# Altium schematic sheet LightDimmer.SchDoc
size A4
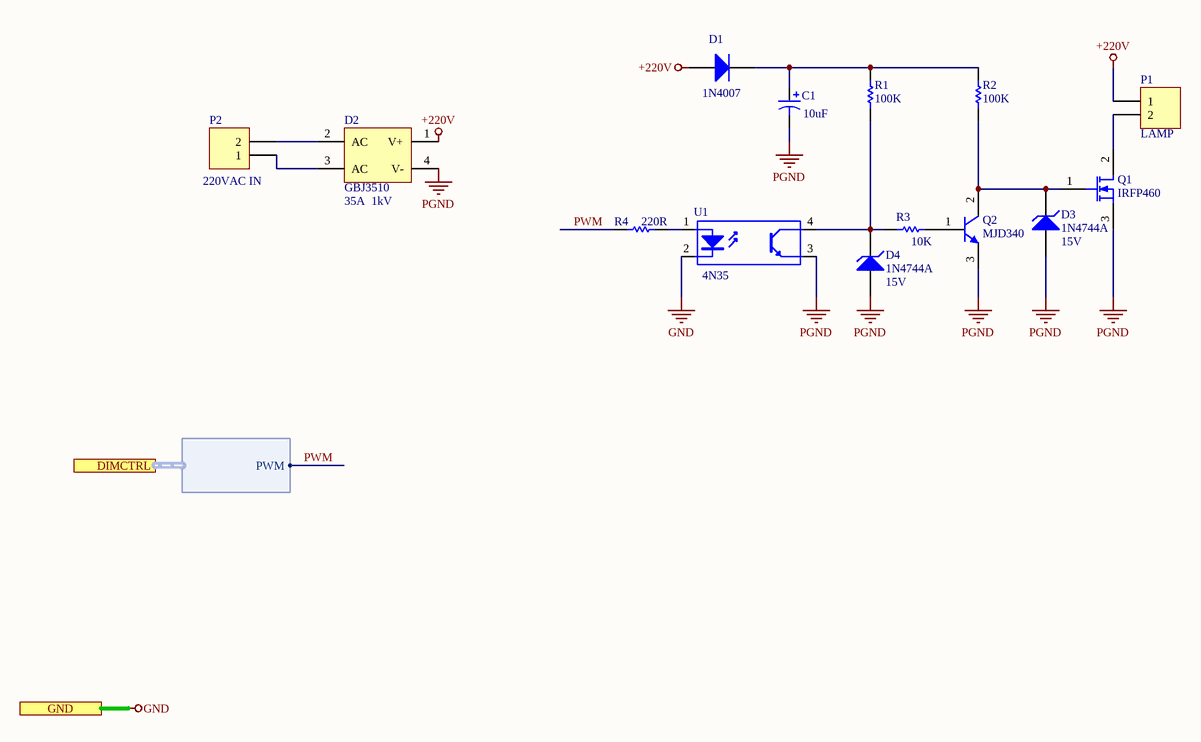
[diagram p0: LightDimmer.SchDoc]

## Parts
C1  value 10uF  [RB7.6-15]  (hidden comment: 10uF/400V)
D1  1N4007  [D-SOD-80]
D2  GBJ3510  Forward Current: 35A  Max Repetitive Reverse Voltage (Vrrm): 1kV  [D-46_6A]
D3  1N4744A  Zener Voltage: 15V  [DIODE-0.7]
D4  1N4744A  Zener Voltage: 15V  [DIODE-0.7]
P1  value LAMP  [HDR1X2]  (hidden comment: KF128-2P)
P2  value 220VAC IN  [HDR1X2]  (hidden comment: KF128-2P)
Q1  IRFP460  [TO-247-3B]
Q2  MJD340  [TO-252-3]
R1  100K  [AXIAL-0.3]
R2  100K  [AXIAL-0.3]
R3  10K  [AXIAL-0.3]
R4  220R  [AXIAL-0.3]
U1  4N35  [DIP-4]

## Ports
DIMCTRL (harness DIMCTRL), GND

## Harnesses
DIMCTRL: PWM

## Nets
+220V: D1.1(A) D2.1(V+) P1.1
GND: U1.2(K) ; port GND
PGND: C1.2 D2.4(V-) D3.1(A) D4.1(A) Q1.3(S) Q2.3(E) U1.3(E)
PWM: R4.2 ; port DIMCTRL.PWM
NetC1_1: C1.1 D1.2(K) R1.1 R2.1
NetD2_2: D2.2(AC) P2.2
NetD2_3: D2.3(AC) P2.1
NetD3_2: D3.2(K) Q1.1(G) Q2.2(C) R2.2
NetD4_2: D4.2(K) R1.2 R3.2 U1.4(C)
NetP1_2: P1.2 Q1.2(D)
NetQ2_1: Q2.1(B) R3.1
NetR4_1: R4.1 U1.1(A)

## Library data of the parts
C1 = Cap Pol1: Polarized Capacitor (Radial); Published: 8-Jun-2000; LatestRevisionDate: 17-Jul-2002; LatestRevisionNote: Re-released for DXP Platform.; PackageReference: RB7.6-15; Publisher: Altium Limited; PackageDescription: Polarized Capacitor (Radial); 2 Leads
D1 = Diode 1N4004: 1 Amp General Purpose Rectifier (M7); Published: 8-Jun-2000; LatestRevisionDate: 17-Jul-2002; LatestRevisionNote: Re-released for DXP Platform.; DatasheetDocument: 1998; PackageDocument: Aug-1999; PackageReference: DO-41; Value: 1N4007; Code_JEDEC: DO-204-AL; ComponentLink1Description: Manufacturer Link; ComponentLink1URL: http://www.fairchildsemi.com/; ComponentLink2Description: Datasheet; ComponentLink2URL: http://www.fairchildsemi.com/ds/1N%2F1N4001.pdf
D2 = Bridge2: 35A/1000V; Manufacturer: MCC; Manufacturer Part Number: GBJ3510-BP; Forward Voltage: 1.05V; Peak Reverse Current: 10uA; Capacitance: 2.2nF; Tolerance: 80%; Voltage Rating: 3.15kV; Max Forward Surge Current (Ifsm): 350A; Number of Elements: 1; Lead/Base Style: Formed Leads; Supplier 1: Digi-Key; Supplier Part Number 1: GBJ3510-BPMS-ND; RoHS: Yes; Stock 1: 4750; Pricing 1: 1 = 2.02000, 10 = 1.82000, 25 = 1.62520, 100 = 1.46250, 250 = 1.30000, 750 = 1.02700, 1500 = 0.94250, 3000 = 0.87750, 5250 = 0.84500 (USD); Mount: Through Hole; Case/Package: Radial; Number of Pins: 4; Min Operating Temperature: -25°C; Max Operating Temperature: 150°C; Package Quantity: 900; Packaging: Bulk; Peak Non-Repetitive Surge Current: 350A; Length: 30.3mm; Height: 20.3mm; Width: 4.8mm; Height - Seated (Max): 0.512inch; Lead Pitch: 0.295inch; Radiation Hardening: No; Lead Free: Lead Free
D3 D4 = D Zener: 1W 15V; Manufacturer: MCC; Manufacturer Part Number: 1N4744A-TP; Material: Glass; Impedance: 14R; Element Configuration: Single; Tolerance: 5%; Max Reverse Leakage Current: 5uA; Test Current: 17mA; Output Current: 1.5A; Zener Current: 61mA; Supplier 1: Digi-Key; Supplier Part Number 1: 1N4744A-TPCT-ND; RoHS: Yes; Stock 1: 4052; Pricing 1: 1 = 0.27000, 10 = 0.24300, 25 = 0.17520, 100 = 0.13630, 250 = 0.08564, 500 = 0.07300, 1000 = 0.04964, 2500 = 0.04478 (USD); Mount: Through Hole; Number of Pins: 2; Min Operating Temperature: -65°C; Max Operating Temperature: 200°C; Packaging: Tape and Reel; Max Power Dissipation: 1W; Voltage Tolerance: 5%; Power Dissipation: 1W; Package Quantity: 1; Voltage Rating (DC): 15V; Power Rating: 1W; Radiation Hardening: No; Lead Free: Lead Free; REACH SVHC: Unknown; ComponentLink1URL: http://www.mccsemi.com/up_pdf/1N4728-1N4761(DO-41G).pdf; ComponentLink1Description: http://www.mccsemi.com/up_pdf/1N4728-1N4761(DO-41G).pdf; ComponentLink2URL: https://www.verical.com/server-webapp/html/getDatasheet?partID=103625; ComponentLink2Description: https://www.verical.com/server-webapp/html/getDatasheet?partID=103625
P1 P2 = Header 2: Header, 2-Pin; LatestRevisionDate: 17-Jul-2002; LatestRevisionNote: Re-released for DXP Platform.
Q1 = MOSFET-N: N-Channel MOSFET 500V/20A; Manufacturer: Vishay; Manufacturer Part Number: IRFP460PBF; Continuous Drain Current (ID): 20A; Drain to Source Voltage (Vdss): 500V; Gate to Source Voltage (Vgs): 20V; Max Power Dissipation: 280W; Rise Time: 59ns; Drain to Source Resistance: 270mR; Input Capacitance: 4.2nF; Fall Time: 58ns; Turn-On Delay Time: 18ns; Element Configuration: Single; Turn-Off Delay Time: 110ns; Number of Channels: 1; Threshold Voltage: 4V; Recovery Time: 860ns; ComponentLink1URL: https://www.distrelec.biz/Web/Downloads/ta/_e/hkIRFP460_Data_E.pdf?mime=application%2Fpdf; ComponentLink1Description: https://www.distrelec.biz/Web/Downloads/ta/_e/hkIRFP460_Data_E.pdf?mime=application%2Fpdf; ComponentLink2URL: http://www.vishay.com/docs/91237/91237.pdf; ComponentLink2Description: http://www.vishay.com/docs/91237/91237.pdf; ComponentLink3URL: http://docs-europe.electrocomponents.com/webdocs/0791/0900766b8079122f.pdf; ComponentLink3Description: http://docs-europe.electrocomponents.com/webdocs/0791/0900766b8079122f.pdf; ComponentLink4URL: https://www.verical.com/server-webapp/html/getDatasheet?partID=107620; ComponentLink4Description: https://www.verical.com/server-webapp/html/getDatasheet?partID=107620; ComponentLink5URL: http://www.farnell.com/datasheets/1866611.pdf; ComponentLink5Description: http://www.farnell.com/datasheets/1866611.pdf; ComponentLink6URL: http://datasheet.iiic.cc/vishay_[siliconix]/IRFP460PBF.pdf; ComponentLink6Description: http://datasheet.iiic.cc/vishay_[siliconix]/IRFP460PBF.pdf; Supplier 1: Digi-Key; Supplier Part Number 1: IRFP460PBF-ND; RoHS: Yes; Stock 1: 7; Pricing 1: 1 = 4.30000, 25 = 3.45680, 100 = 3.14960, 500 = 2.55038, 1000 = 2.15092 (USD); Mount: Through Hole; Case/Package: TO-247-3; Number of Pins: 3; Weight: 1.340411oz; Min Operating Temperature: -55°C; Max Operating Temperature: 150°C; Packaging: Rail/Tube; Package Quantity: 25; Voltage Rating (DC): 500V; Current Rating: 20A; Rds On Max: 270mR; Power Dissipation: 280W; Drain to Source Breakdown Voltage: 500V; Number of Elements: 1; Nominal Vgs: 4V; On-State Resistance: 270MR; Length: 15.87mm; Height: 20.7mm; Width: 5.31mm; Radiation Hardening: No; Lead Free: Lead Free; REACH SVHC: Unknown
Q2 = NPN: NPN Bipolar Transistor; Manufacturer: ON Semiconductor; Manufacturer Part Number: MJD340T4G; Collector Emitter Voltage (VCEO): 300V; Max Power Dissipation: 1.56W; Max Collector Current: 500mA; Emitter Base Voltage (VEBO): 3V; Element Configuration: Single; hFE Min: 30; Number of Elements: 1; Transition Frequency: 10MHz; Collector Emitter Saturation Voltage: 1V; ComponentLink1URL: http://www.mouser.com/ds/2/258/MMSS8050-255048.pdf; ComponentLink1Description: http://www.mouser.com/ds/2/258/MMSS8050-255048.pdf; ComponentLink2URL: http://www.mccsemi.com/up_pdf/MMSS8050(SOT-23).pdf; ComponentLink2Description: http://www.mccsemi.com/up_pdf/MMSS8050(SOT-23).pdf; Supplier 1: Digi-Key; Supplier Part Number 1: MJD340T4GOSCT-ND; RoHS: Yes; Stock 1: 12690; Pricing 1: 1 = 0.60000, 10 = 0.51100, 100 = 0.38130, 500 = 0.29956, 1000 = 0.23148 (USD); Case/Package: DPAK; Number of Pins: 3; Weight: 0.01lb; Contact Plating: Matte,Tin; Min Operating Temperature: -65°C; Max Operating Temperature: 150°C; Packaging: Tape and Reel; Package Quantity: 1; Polarity: NPN; Collector Emitter Breakdown Voltage: 300V; Collector Base Voltage (VCBO): 300V; Power Dissipation: 1.56W; Voltage Rating (DC): 300V; Current Rating: 500mA; Max Breakdown Voltage: 300V; Length: 6.73mm; Height: 2.38mm; Width: 6.22mm; Radiation Hardening: No; Lead Free: Lead Free; REACH SVHC: No SVHC; ComponentLink3URL: http://www.onsemi.com/pub/Collateral/MJD340-D.PDF; ComponentLink3Description: http://www.onsemi.com/pub/Collateral/MJD340-D.PDF; ComponentLink4URL: http://www.jameco.com/Jameco/Products/ProdDS/2023388.pdf; ComponentLink4Description: http://www.jameco.com/Jameco/Products/ProdDS/2023388.pdf; ComponentLink5URL: https://www.verical.com/server-webapp/html/getDatasheet?partID=41072; ComponentLink5Description: https://www.verical.com/server-webapp/html/getDatasheet?partID=41072; ComponentLink6URL: http://datasheet.iiic.cc/on_semiconductor/MJD340T4G.pdf; ComponentLink6Description: http://datasheet.iiic.cc/on_semiconductor/MJD340T4G.pdf
R1-R4 = Res1: Resistor; Supplier 1: Digi-Key; Supplier Part Number 1: P4.7KGCT-ND
U1 = Optoisolator1: 4-Pin Phototransistor Optocoupler; Manufacturer: Vishay; Max Power Dissipation: 70mW; Number of Channels: 1; Output Voltage: 30V; Isolation Voltage: 5kV; Max Input Current: 60mA; Forward Voltage: 1.5V; Reverse Breakdown Voltage: 6V; Forward Current: 50mA; Collector Emitter Saturation Voltage: 300mV; Rise Time: 3us; Output Current per Channel: 100mA; Current Transfer Ratio: 50%; Input Current: 10mA; Approvals: BSI,FIMKO,UL; Supplier 1: Digi-Key; Supplier Part Number 1: 4N35-ND; Manufacturer Part Number: 4N35; RoHS: Yes; Stock 1: 18474; Pricing 1: 1 = 0.60000, 10 = 0.46400, 25 = 0.38680, 100 = 0.33320, 250 = 0.29752, 500 = 0.25586, 2000 = 0.17850, 6000 = 0.16660 (USD); Mount: Through Hole; Case/Package: DIP; Number of Pins: 6; Min Operating Temperature: -55°C; Max Operating Temperature: 100°C; Packaging: Rail/Tube; Package Quantity: 2000; Collector Emitter Voltage (VCEO): 30V; Power Dissipation: 70mW; Number of Elements: 1; Max Output Voltage: 30V; Max Collector Current: 100mA; Number of Circuits: 1; Collector Emitter Breakdown Voltage: 30V; Reverse Voltage (DC): 6V; Radiation Hardening: No; Lead Free: Lead Free; REACH SVHC: Unknown; ComponentLink1URL: https://www.verical.com/server-webapp/html/getDatasheet?partID=103269; ComponentLink1Description: https://www.verical.com/server-webapp/html/getDatasheet?partID=103269; ComponentLink2URL: http://uk.rs-online.com/webdocs/0dca/0900766b80dca9c8.pdf; ComponentLink2Description: http://uk.rs-online.com/webdocs/0dca/0900766b80dca9c8.pdf; ComponentLink3URL: http://www.farnell.com/datasheets/2047068.pdf; ComponentLink3Description: http://www.farnell.com/datasheets/2047068.pdf; ComponentLink4URL: http://www.vishay.com/docs/81181/4n35.pdf; ComponentLink4Description: http://www.vishay.com/docs/81181/4n35.pdf; ComponentLink5URL: https://www.distrelec.biz/Web/Downloads/_t/ds/4n35-7_eng_tds.pdf?mime=application%2Fpdf; ComponentLink5Description: https://www.distrelec.biz/Web/Downloads/_t/ds/4n35-7_eng_tds.pdf?mime=application%2Fpdf; ComponentLink6URL: http://www.onlinecomponents.com/productFiles/mf-LI/2s_110_4n3520204n372020m20s20s-ta12020rev.pdf; ComponentLink6Description: http://www.onlinecomponents.com/productFiles/mf-LI/2s_110_4n3520204n372020m20s20s-ta12020rev.pdf; ComponentLink7URL: http://www.farnell.com/datasheets/1533488.pdf; ComponentLink7Description: http://www.farnell.com/datasheets/1533488.pdf; ComponentLink8URL: http://optoelectronics.liteon.com/upload/download/DS-70-99-0012/4N3X%20Series%201115.pdf; ComponentLink8Description: http://optoelectronics.liteon.com/upload/download/DS-70-99-0012/4N3X%20Series%201115.pdf; ComponentLink9URL: http://www.produktinfo.conrad.com/datenblaetter/150000-174999/152890-da-01-en-Optocoupler_4N35.pdf; ComponentLink9Description: http://www.produktinfo.conrad.com/datenblaetter/150000-174999/152890-da-01-en-Optocoupler_4N35.pdf